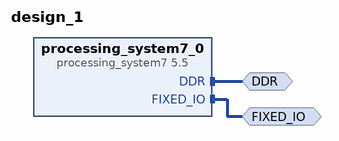
[diagram p0: block diagram of the top level]
# Vivado block design design_1, xc7z010clg400-1, Vivado 2019.1
create_bd_design design_1

create_bd_intf_port -mode Master -vlnv xilinx.com:interface:ddrx_rtl:1.0 DDR
create_bd_intf_port -mode Master -vlnv xilinx.com:display_processing_system7:fixedio_rtl:1.0 FIXED_IO

create_bd_cell -type ip -vlnv xilinx.com:ip:processing_system7:5.5 processing_system7_0
set_property -dict [list \
  CONFIG.PCW_APU_PERIPHERAL_FREQMHZ 666.666666 \
  CONFIG.PCW_ENET0_PERIPHERAL_ENABLE 0 \
  CONFIG.PCW_EN_CLK0_PORT 0 \
  CONFIG.PCW_EN_RST0_PORT 0 \
  CONFIG.PCW_GPIO_MIO_GPIO_ENABLE 0 \
  CONFIG.PCW_PRESET_BANK1_VOLTAGE {LVCMOS 1.8V} \
  CONFIG.PCW_QSPI_GRP_FBCLK_ENABLE 1 \
  CONFIG.PCW_QSPI_GRP_FBCLK_IO {MIO 8} \
  CONFIG.PCW_QSPI_GRP_SINGLE_SS_ENABLE 1 \
  CONFIG.PCW_QSPI_GRP_SINGLE_SS_IO {MIO 1 .. 6} \
  CONFIG.PCW_QSPI_PERIPHERAL_ENABLE 1 \
  CONFIG.PCW_QSPI_QSPI_IO {MIO 1 .. 6} \
  CONFIG.PCW_SD0_PERIPHERAL_ENABLE 0 \
  CONFIG.PCW_SDIO_PERIPHERAL_FREQMHZ 50 \
  CONFIG.PCW_SINGLE_QSPI_DATA_MODE x4 \
  CONFIG.PCW_UART1_PERIPHERAL_ENABLE 1 \
  CONFIG.PCW_UART1_UART1_IO {MIO 48 .. 49} \
  CONFIG.PCW_UART_PERIPHERAL_FREQMHZ 100 \
  CONFIG.PCW_UIPARAM_DDR_FREQ_MHZ 533.333333 \
  CONFIG.PCW_UIPARAM_DDR_MEMORY_TYPE {DDR 3 (Low Voltage)} \
  CONFIG.PCW_UIPARAM_DDR_PARTNO {MT41K256M16 RE-125} \
  CONFIG.PCW_USB0_PERIPHERAL_ENABLE 0 \
  CONFIG.PCW_USE_M_AXI_GP0 0 \
] [get_bd_cells processing_system7_0]
# 158 more settings of processing_system7_0 are not shown: defaults, MIO pin electricals, DDR timing, and values the tool derives

# ---- connections ----

connect_bd_intf_net [get_bd_intf_ports DDR] [get_bd_intf_pins processing_system7_0/DDR]
connect_bd_intf_net [get_bd_intf_ports FIXED_IO] [get_bd_intf_pins processing_system7_0/FIXED_IO]

validate_bd_design
save_bd_design
